# Altium project bdcmc-24.PrjPcb
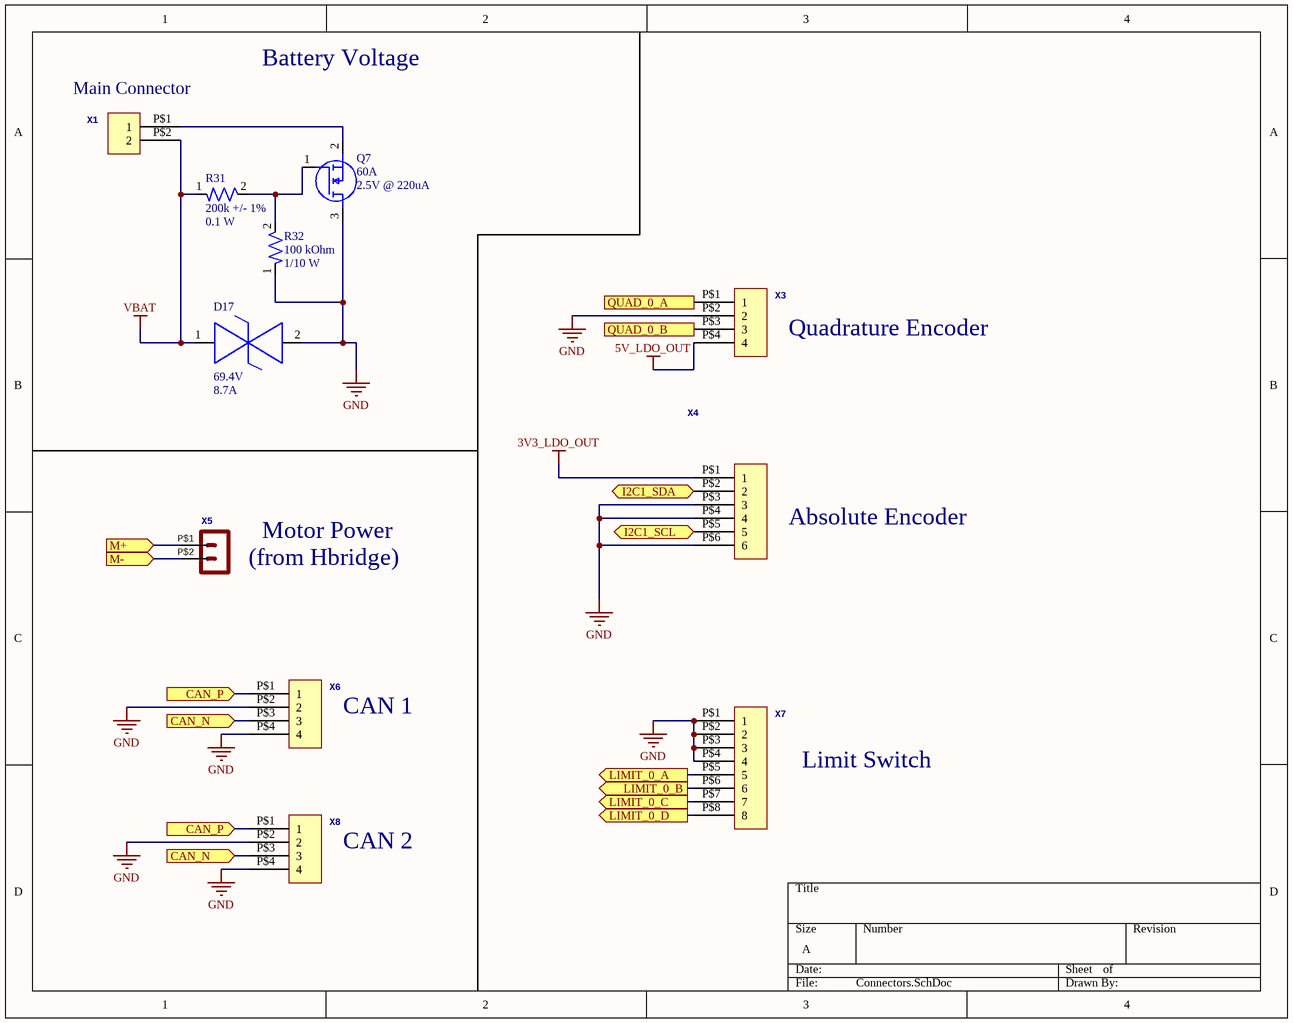
[diagram p0: Connectors.SchDoc]
1 sheet, 11 parts. Net scope: flat (ports and power ports of the same name join across sheets).
Board file: BDCMC_PCB.PcbDoc

## Sheet Connectors.SchDoc
size A; SheetNumber: 1; SheetTotal: 5

### Parts
D17  Vclamp: 69.4V  Peak pulser current: 8.7A  [DO-214AA (SMBJ)]  (hidden comment: SMBJE43CAH)
Q7  Drain Current: 60A  Vgs: 2.5V @ 220uA  [NMOS-8PowerVDFN]  (hidden comment: TPH7R006PL,L1Q)
R31  Resistance: 200k +/- 1%  Power Rating: 0.1 W  [RES-0603]  (hidden comment: ERJ-3EKF2003V)
R32  Resistance: 100 kOhm  Power: 1/10 W  [RES-0603]  (hidden comment: RC0603FR-07100KL)
X1  Molex 43650-0215  [43650-0215]  (value not drawn)
X3  Molex 43045-0412  [43045-0412]  (value not drawn)
X4  Molex 43045-0612  [43045-0612]  (value not drawn)
X5  Molex - Micro-Fit 3.0 Series connector,  3.00mm (0.118") pitch header, 2 positions.  [43045-0212]  (value not drawn)
X6  Molex 43045-0412  [43045-0412]  (value not drawn)
X7  Molex 43045-0812  [43045-0812]  (value not drawn)
X8  Molex 43045-0412  [43045-0412]  (value not drawn)

### Ports
CAN_N (in, see Connectors[1C], MCU_CAN[6B]), CAN_N (in, see Connectors[1D], MCU_CAN[6B]), CAN_P (in, see Connectors[1C], MCU_CAN[6A]), CAN_P (in, see Connectors[1D], MCU_CAN[6A]), I2C1_SCL (bidir, see MCU_CAN[3B]), I2C1_SDA (bidir, see MCU_CAN[3B]), LIMIT_0_A (out, see MCU_CAN[2C]), LIMIT_0_B (out, see MCU_CAN[2C]), LIMIT_0_C (out, see MCU_CAN[2C]), LIMIT_0_D (out, see MCU_CAN[2C]), M+ (in, see HBridge_Design[2B]), M- (in, see HBridge_Design[2B]), QUAD_0_A (out, see MCU_CAN[3B]), QUAD_0_B (out, see MCU_CAN[3B])

### Nets
3V3_LDO_OUT: X4.P$1(1)
5V_LDO_OUT: X3.P$4(4)
GND: D17.2 Q7.3(D) R32.1 X3.P$2(2) X4.P$3(3) X4.P$4(4) X4.P$6(6) X6.P$2(2) X6.P$4(4) X7.P$1(1) X7.P$2(2) X7.P$3(3) X7.P$4(4) X8.P$2(2) X8.P$4(4)
VBAT: D17.1 R31.1 X1.P$2(2)
NetQ7_1: Q7.1(G) R31.2 R32.2
NetQ7_2: Q7.2(S) X1.P$1(1)
NetX3_P$1: X3.P$1(1) ; port QUAD_0_A
NetX3_P$3: X3.P$3(3) ; port QUAD_0_B
NetX4_P$2: X4.P$2(2) ; port I2C1_SDA
NetX4_P$5: X4.P$5(5) ; port I2C1_SCL
NetX5_P$1: X5.P$1 ; port M+
NetX5_P$2: X5.P$2 ; port M-
NetX6_P$1: X6.P$1(1) X8.P$1(1) ; port CAN_P
NetX6_P$3: X6.P$3(3) X8.P$3(3) ; port CAN_N
NetX7_P$5: X7.P$5(5) ; port LIMIT_0_A
NetX7_P$6: X7.P$6(6) ; port LIMIT_0_B
NetX7_P$7: X7.P$7(7) ; port LIMIT_0_C
NetX7_P$8: X7.P$8(8) ; port LIMIT_0_D

### Notes on the sheet
- (near X1) Main Connector
- Battery Voltage
- Quadrature Encoder
- (near X5) (from Hbridge)
- Motor Power
- Absolute Encoder
- CAN 1
- Limit Switch
- CAN 2

### Library data of the parts
D17 = DIO-69.4V-0001: 69.4V Clamp 8.7A Ipp Tvs Diode Surface Mount DO-214AA (SMBJ); Channels: Bidirectional; Breakdown VOltage: 47.8V; Reverse working maximum voltage: 43V; Package: DO-214AA (SMBJ)
Q7 = NMOS-60A-0001: N-Channel 60 V 60A (Tc) 81W (Tc) Surface Mount 8-SOP Advance (5x5); Vdss: 60V; Vgs(Max): 20V; Package: 8-PowerVDFN
R31 = RES-200K-0001: 200 kOhms ±1% 0.1W, 1/10W Chip Resistor 0603 (1608 Metric) Automotive AEC-Q200 Thick Film; Manufacturer: Panasonic Electronic Components; Assembled?: Yes; MFP: ERJ-3EKF2003V; Package SIze: 0603
R32 = RES-100K-0003: 100 kOhms ±1% 0.1W, 1/10W Chip Resistor 0603 (1608 Metric) Moisture Resistant Thick Film; Tolerance: +/- 1%; Assembled?: No; Package Size: 0603
X1 = Micro-Fit Molex 2 Pin Vertical: GateName_1: G$1; SymbolName_1: HEADER_POS2; DeviceSetName: HEADER_POS2_?; DeviceName: 43650-0215; LibraryName: con-molex-micro-fit-3_0_2; Package: 43650-0215
X3 X6 X8 = Micro-Fit Molex 4 Pin 2 Row Vertical: GateName_1: G$1; SymbolName_1: HEADER_POS4; DeviceSetName: HEADER_POS4_?; DeviceName: 43045-0412; LibraryName: con-molex-micro-fit-3_0_2; Package: 43045-0412
X4 = Micro-Fit Molex 6 Pin 2 Row Vertical: GateName_1: G$1; SymbolName_1: HEADER_POS6; DeviceSetName: HEADER_POS6_?; DeviceName: 43045-0612; LibraryName: con-molex-micro-fit-3_0_2; Package: 43045-0612
X5 = HEADER_POS2_?43045-0212: GateName_1: G$1; SymbolName_1: HEADER_POS2; DeviceName: 43045-0212; LibraryName: con-molex-micro-fit-3_0_2; DeviceSetName: HEADER_POS2_?; Package: 43045-0212
X7 = Micro-Fit Molex 8 Pin 2 Row Vertical: GateName_1: G$1; SymbolName_1: HEADER_POS8; DeviceSetName: HEADER_POS8_?; DeviceName: 43045-0812; LibraryName: con-molex-micro-fit-3_0_2; Package: 43045-0812